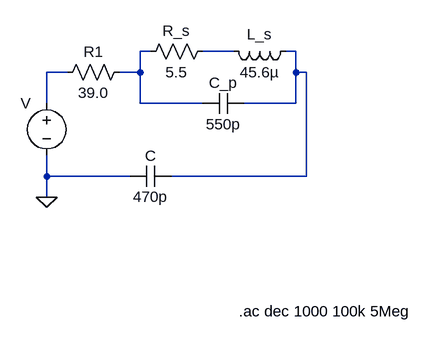
[diagram p0: schematic RLC.asc]
RLC.asc, the LTspice schematic file:
Version 4
SHEET 1 880 680
WIRE 256 32 240 32
WIRE 384 32 336 32
WIRE 480 32 464 32
WIRE 128 64 96 64
WIRE 240 64 240 32
WIRE 240 64 208 64
WIRE 480 64 480 32
WIRE 496 64 480 64
WIRE 96 112 96 64
WIRE 240 112 240 64
WIRE 336 112 240 112
WIRE 480 112 480 64
WIRE 480 112 400 112
WIRE 96 224 96 192
WIRE 224 224 96 224
WIRE 496 224 496 64
WIRE 496 224 288 224
WIRE 96 256 96 224
FLAG 96 256 0
SYMBOL voltage 96 96 R0
WINDOW 3 24 152 Left 2
WINDOW 123 24 124 Left 2
WINDOW 39 0 0 Left 2
WINDOW 0 -40 16 Left 2
SYMATTR Value ""
SYMATTR InstName V
SYMBOL res 224 48 R90
WINDOW 0 0 56 VBottom 2
WINDOW 3 32 56 VTop 2
SYMATTR InstName R1
SYMATTR Value 39.0
SYMBOL res 352 16 R90
WINDOW 0 0 56 VBottom 2
WINDOW 3 32 56 VTop 2
SYMATTR InstName R_s
SYMATTR Value 5.5
SYMBOL ind 480 16 R90
WINDOW 0 5 56 VBottom 2
WINDOW 3 32 56 VTop 2
SYMATTR InstName L_s
SYMATTR Value 45.6µ
SYMBOL cap 400 96 R90
WINDOW 0 0 32 VBottom 2
WINDOW 3 32 32 VTop 2
SYMATTR InstName C_p
SYMATTR Value 550p
SYMBOL cap 288 208 R90
WINDOW 0 0 32 VBottom 2
WINDOW 3 32 32 VTop 2
SYMATTR InstName C
SYMATTR Value 470p
TEXT 392 432 Left 2 !.ac dec 1000 100k 5Meg

The netlist it stands for:
* RLC.asc
V N004 0
R1 N001 N004 39.0
R_s N002 N001 5.5
L_s N003 N002 45.6µ
C_p N003 N001 550p
C N003 0 470p
.ac dec 1000 100k 5Meg
.backanno
.end